# Altium schematic sheet ESP32.SchDoc
size A; SheetNumber: 5; SheetTotal: 5
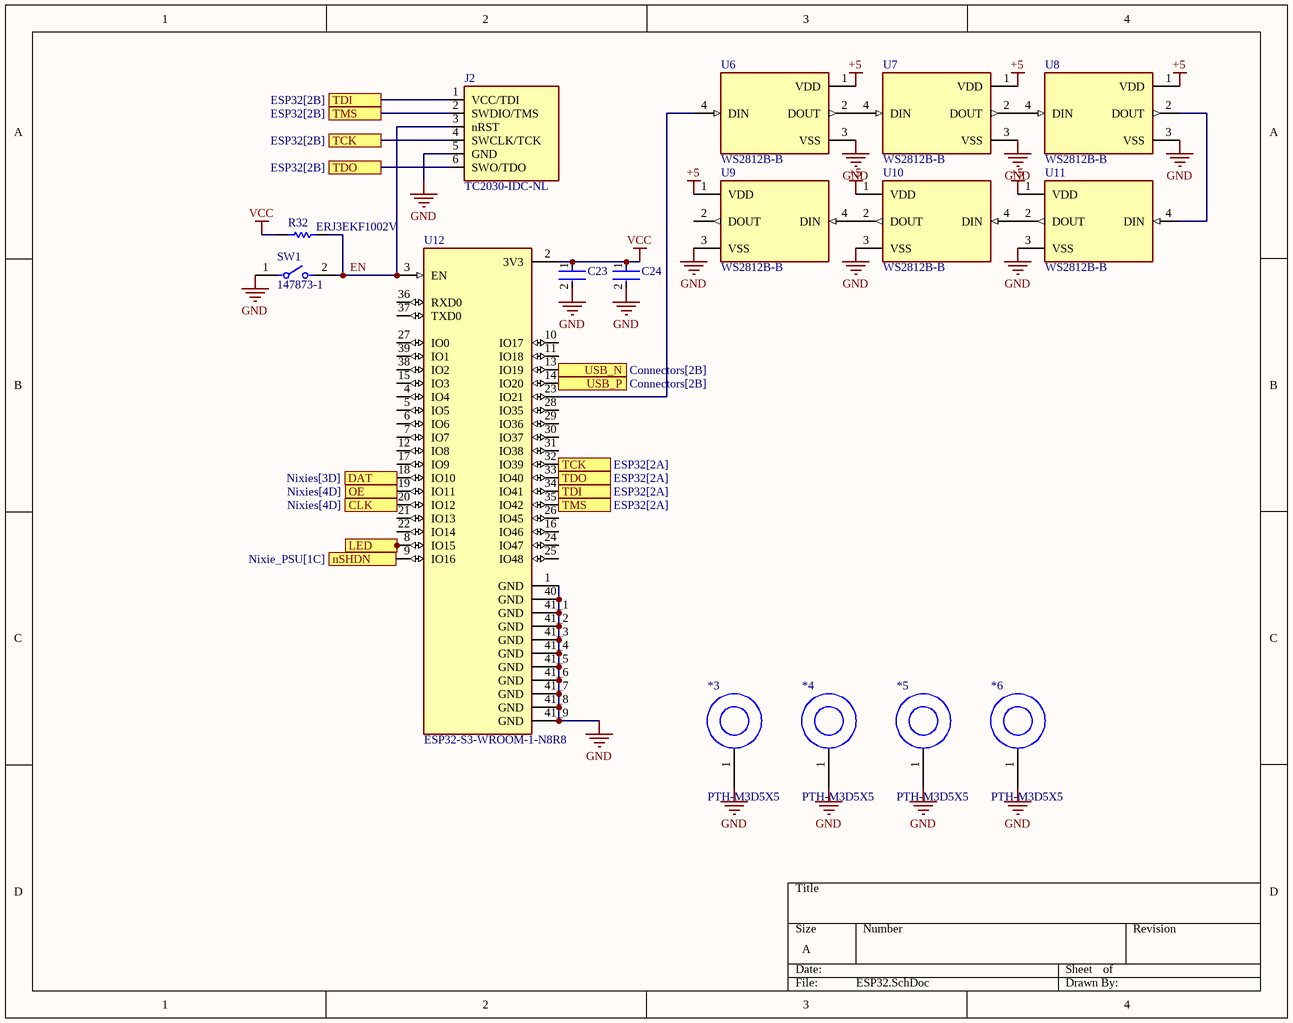
[diagram p0: ESP32.SchDoc]

## Parts
*3  PTH-M3D5X5  [PTH-M3D5X5-Footprint-1]
*4  PTH-M3D5X5  [PTH-M3D5X5-Footprint-1]
*5  PTH-M3D5X5  [PTH-M3D5X5-Footprint-1]
*6  PTH-M3D5X5  [PTH-M3D5X5-Footprint-1]
C23  GRM188R60J476ME15D  [FP-GRM188-0_2-IPC_B]  (value not drawn)
C24  GRM188R60J476ME15D  [FP-GRM188-0_2-IPC_B]  (value not drawn)
J2  TC2030-IDC-NL  [TAG_TC2030-IDC-NL]
R32  ERJ3EKF1002V  [RESC1609X55X30LL15T15]
SW1  147873-1  [FP-147873-1-MFG]
U6  WS2812B-B  [LED_WS2812B-B]
U7  WS2812B-B  [LED_WS2812B-B]
U8  WS2812B-B  [LED_WS2812B-B]
U9  WS2812B-B  [LED_WS2812B-B]
U10  WS2812B-B  [LED_WS2812B-B]
U11  WS2812B-B  [LED_WS2812B-B]
U12  ESP32-S3-WROOM-1-N8R8  [XCVR_ESP32S3WROOM1N8R8]

## Ports
CLK (see Nixies[4D]), DAT (see Nixies[3D]), LED, nSHDN (see Nixie_PSU[1C]), OE (see Nixies[4D]), TCK (see ESP32[2A]), TCK (see ESP32[2B]), TDI (see ESP32[2A]), TDI (see ESP32[2B]), TDO (see ESP32[2A]), TDO (see ESP32[2B]), TMS (see ESP32[2A]), TMS (see ESP32[2B]), USB_N (see Connectors[2B]), USB_P (see Connectors[2B])

## Nets
+5: U6.1(VDD) U7.1(VDD) U8.1(VDD) U9.1(VDD) U10.1(VDD) U11.1(VDD)
GND: *3.1 *4.1 *5.1 *6.1 C23.2 C24.2 J2.5(GND) SW1.1 U6.3(VSS) U7.3(VSS) U8.3(VSS) U9.3(VSS) U10.3(VSS) U11.3(VSS) U12.1(GND) U12.40(GND) U12.41_1(GND) U12.41_2(GND) U12.41_3(GND) U12.41_4(GND) U12.41_5(GND) U12.41_6(GND) U12.41_7(GND) U12.41_8(GND) U12.41_9(GND)
VCC: C23.1 C24.1 R32.2 U12.2(3V3)
CLK: U12.20(IO12) ; port CLK
DAT: U12.18(IO10) ; port DAT
EN: J2.3(nRST) R32.1 SW1.2 U12.3(EN)
LED: U12.8(IO15) ; port LED
nSHDN: U12.9(IO16) ; port nSHDN
OE: U12.19(IO11) ; port OE
TCK: J2.4(SWCLK/TCK) U12.32(IO39) ; port TCK
TDI: J2.1(VCC/TDI) U12.34(IO41) ; port TDI
TDO: J2.6(SWO/TDO) U12.33(IO40) ; port TDO
TMS: J2.2(SWDIO/TMS) U12.35(IO42) ; port TMS
USB_N: U12.13(IO19) ; port USB_N
USB_P: U12.14(IO20) ; port USB_P
NetU6_2: U6.2(DOUT) U7.4(DIN)
NetU6_4: U6.4(DIN) U12.23(IO21)
NetU7_2: U7.2(DOUT) U8.4(DIN)
NetU8_2: U8.2(DOUT) U11.4(DIN)
NetU9_4: U9.4(DIN) U10.2(DOUT)
NetU10_4: U10.4(DIN) U11.2(DOUT)

Not connected (* = marked no-connect by the designer): U9 2(DOUT); U12 4(IO4) 5(IO5) 6(IO6) 7(IO7) 10(IO17) 11(IO18) 12(IO8) 15(IO3) 16(IO46) 17(IO9) 21(IO13) 22(IO14) 24(IO47) 25(IO48) 26(IO45) 27(IO0) 28(IO35) 29(IO36) 30(IO37) 31(IO38) 36(RXD0) 37(TXD0) 38(IO2) 39(IO1)

## Library data of the parts
*3-*6 = CMP-010-00024-1: Plated Thru-Hole M3 D5X5; Pins: 1; Mounting Technology: TH
C23 C24 = CMP-2000-05444-2: Chip Multilayer Ceramic Capacitors for General Purpose, 0603, 47uF, X5R, 15%, 20%, 6.3V; Voltage Rating (DC): 6.3V; Thickness: 0.039inch; Case Code (Imperial): 0603; Packaging: Tape and Reel; Capacitance: 47uF; Width: 0.031inch; Dielectric: X5R; Max Operating Temperature: 85°C; Mount: Surface Mount; Case Code (Metric): 1608; Length: 0.063inch; Voltage Rating: 6.3V; Tolerance: 20%; Case/Package: 0603; Min Operating Temperature: -55°C
J2 = CMP-070-000001-2: CABLE ADAPTER 6 POS; Package: None; Price: None; Pin Count: 6; Component Type: Standard; Availability: Unavailable; MP: TC2030-IDC-NL; Design Item ID: TC2030-IDC-NL; Value: *; Source: TC2030-IDC-NL.SchLib
R32 = CMP-1012-00623-3: Chip Resistor, 10 KOhm, +/- 1%, 0.1 W, -55 to 155 degC, 0603 (1608 Metric), RoHS, Tape and Reel; Manufacturer: Panasonic; Voltage Rating: 75V; Case\/Package: 0603; Power Rating: 100mW; Resistance: 10KOhm; Temperature Coefficient: 100ppm\/degreesC; Number of Pins: 2; Package Reference: 603; Depth: 0.8mm; Mount: SurfaceMount; Package Description: 2-Pin Surface Mount Device, Body 1.6 x 0.85 mm; Datasheet Version: 02/2017; Length: 1.6mm; Lead Free: LeadFree; Height: 0.45mm; Number of Terminations: 2; Max Power Dissipation: 100mW; Min Operating Temperature: -55degC; Datasheet URL: https://industrial.panasonic.com/cdbs/www-data/pdf/RDA0000/AOA0000C304.pdf; Termination: SMD/SMT; Case Code (Metric): 1608; Case Code (Imperial): 0603; Tolerance: 1%; Max Operating Temperature: 155degC; RoHSCompliant: true; Voltage Rating (DC): 75V; Radiation Hardening: No; Packaging: TapeandReel; Composition: ThickFilm; Mounting Technology: SurfaceMount; Manufacturer URL: http://www.panasonic.com/; Width: 0.031inch; REACH SVHC: NoSVHC; Contact Plating: Tin; Military Standard: Not; Package Quantity: 1
SW1 = CMP-03407-000005-1: SWITCH TACTILE SPST-NO 0.05A 24V; Manufacturer: TE Connectivity; Contact Resistance: 100mΩ; Operating Force: 180gf; Electromechanical Life: 40000Cycles; Contact Current Rating: 50mA; Throw Configuration: SPST-NO; Mouser Description: Switch Tactile OFF (ON) SPST Rectangular Button J-Bend 0.05A 24VDC 1.77N SMD T/R; Mount: Surface Mount; Height: 5.5mm; Category: Switch; RoHS: TRUE; Temperature Range High: +85°C; ComponentLink2Description: Datasheet; Temperature Range Low: -35°C; Device Class L1: Electromechanical; Device Class L2: Switches; Package: 0; Temperature: -35°C to +85°C; Device Class L3: Tactile Switches; Automotive: No; Manufacturer Part Number: 147873-1; ComponentLink2URL: https://www.te.com/commerce/DocumentDelivery/DDEController?Action=showdoc&DocId=Customer+Drawing%7F147873%7FK3%7Fpdf%7FEnglish%7FENG_CD_147873_K3.pdf%7F147873-1; Lead Free: Yes; Voltage Rating Dc: 24V; Octopart: https://octopart.com/147873-1-te+connectivity-40818451; Digikey Description: SWITCH TACTILE SPST-NO 0.05A 24V
U6-U11 = WS2812B-B: Intelligent control LED integrated light source; MF: {'manufacturer': u'Worldsemi'}; Package: None; Price: None; Value: *; MP: WS2812B-B; Availability: Unavailable
U12 = ESP32-S3-WROOM-1-N8R8: <a href="https://pricing.snapeda.com/parts/ESP32S3WROOM1N8R8/Espressif%20Systems/view-part?ref=eda">Check availability</a>; MF: {'manufacturer': u'Espressif Systems'}; Package: None; Price: None; Value: *; MP: ESP32-S3-WROOM-1-N8R8; Availability: Unavailable